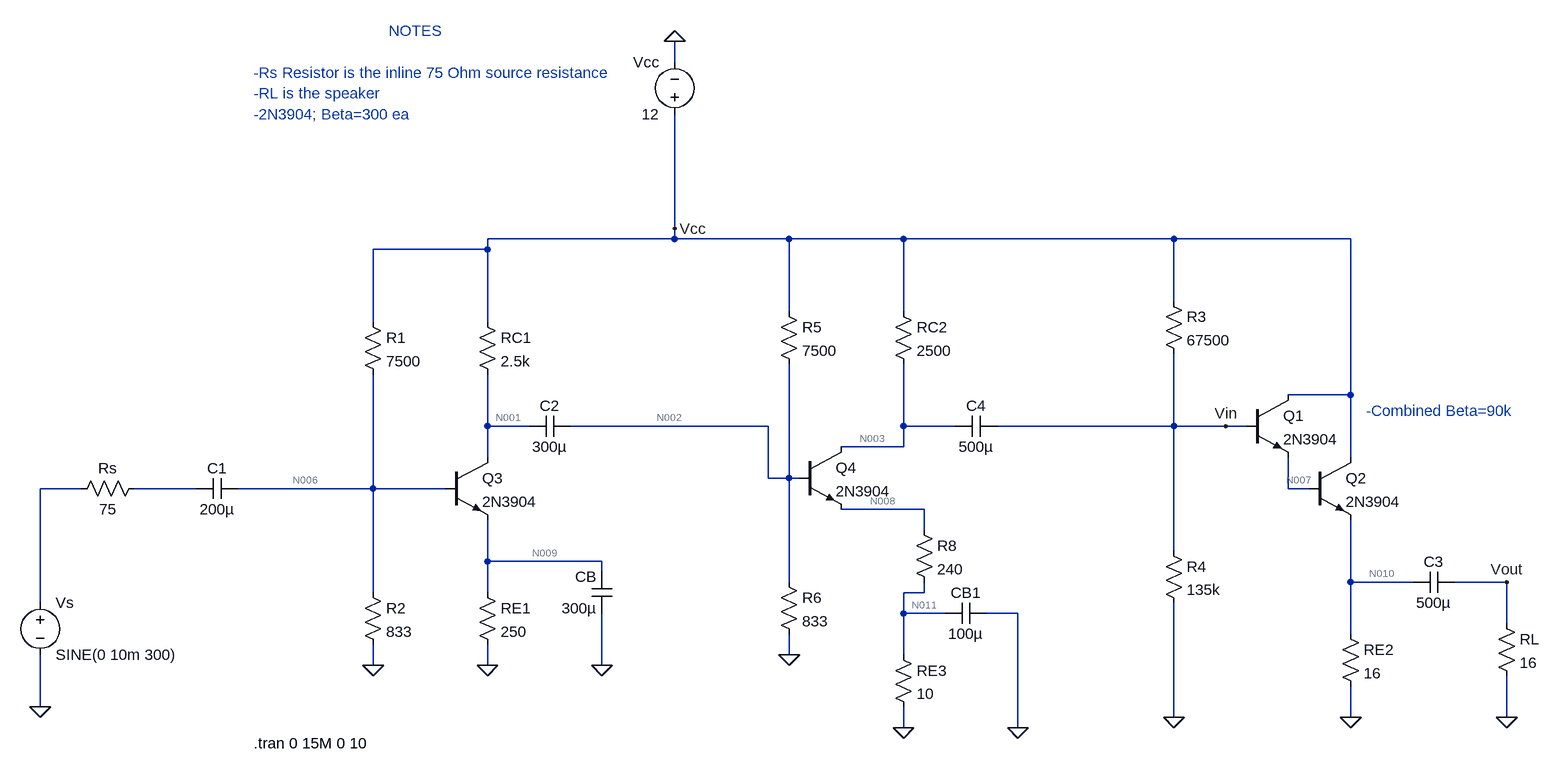
[diagram p0: schematic NewAmpSchematic.asc]
NewAmpSchematic.asc, the LTspice schematic file:
Version 4
SHEET 1 1416 680
WIRE -304 -448 -304 -480
WIRE -304 -192 -304 -368
WIRE -304 -176 -304 -192
WIRE -304 -176 -592 -176
WIRE -128 -176 -304 -176
WIRE 48 -176 -128 -176
WIRE 464 -176 48 -176
WIRE 736 -176 464 -176
WIRE -592 -160 -592 -176
WIRE -592 -160 -768 -160
WIRE 464 -80 464 -176
WIRE -128 -64 -128 -176
WIRE 48 -64 48 -176
WIRE -768 -48 -768 -160
WIRE -592 -48 -592 -160
WIRE 736 64 736 -176
WIRE 736 64 640 64
WIRE -592 112 -592 32
WIRE -528 112 -592 112
WIRE -160 112 -464 112
WIRE 48 112 48 16
WIRE 128 112 48 112
WIRE 464 112 464 0
WIRE 464 112 192 112
WIRE 544 112 464 112
WIRE 576 112 544 112
WIRE 48 144 48 112
WIRE 48 144 -48 144
WIRE -592 160 -592 112
WIRE 736 160 736 64
WIRE -160 192 -160 112
WIRE -128 192 -128 16
WIRE -128 192 -160 192
WIRE -112 192 -128 192
WIRE -1216 208 -1280 208
WIRE -1040 208 -1136 208
WIRE -768 208 -768 32
WIRE -768 208 -976 208
WIRE -656 208 -768 208
WIRE 640 208 640 160
WIRE 672 208 640 208
WIRE 80 240 -48 240
WIRE 80 272 80 240
WIRE 464 304 464 112
WIRE -592 320 -592 256
WIRE -416 320 -592 320
WIRE -416 336 -416 320
WIRE -128 352 -128 192
WIRE 736 352 736 256
WIRE 832 352 736 352
WIRE 976 352 896 352
WIRE -768 368 -768 208
WIRE -592 368 -592 320
WIRE 80 368 80 352
WIRE 80 368 48 368
WIRE -1280 384 -1280 208
WIRE 48 400 48 368
WIRE 112 400 48 400
WIRE 224 400 176 400
WIRE 976 416 976 352
WIRE 736 432 736 352
WIRE -128 464 -128 432
WIRE 48 464 48 400
WIRE -768 480 -768 448
WIRE -592 480 -592 448
WIRE -416 480 -416 400
WIRE -1280 544 -1280 464
WIRE 464 560 464 384
WIRE 736 560 736 512
WIRE 976 560 976 496
WIRE 48 576 48 544
WIRE 224 576 224 400
FLAG -1280 544 0
FLAG 464 560 0
FLAG 736 560 0
FLAG 976 560 0
FLAG 976 352 Vout
FLAG -768 480 0
FLAG -592 480 0
FLAG -416 480 0
FLAG -128 464 0
FLAG 48 576 0
FLAG 224 576 0
FLAG 544 112 Vin
FLAG -304 -192 Vcc
FLAG -304 -480 0
SYMBOL voltage -1280 368 R0
WINDOW 123 0 0 Left 2
WINDOW 39 0 0 Left 2
SYMATTR InstName Vs
SYMATTR Value SINE(0 10m 300)
SYMBOL voltage -304 -352 R180
WINDOW 0 24 96 Left 2
WINDOW 3 24 16 Left 2
SYMATTR InstName Vcc
SYMATTR Value 12
SYMBOL res -1120 192 R90
WINDOW 0 0 56 VBottom 2
WINDOW 3 32 56 VTop 2
SYMATTR InstName Rs
SYMATTR Value 75
SYMBOL cap -976 192 R90
WINDOW 0 0 32 VBottom 2
WINDOW 3 32 32 VTop 2
SYMATTR InstName C1
SYMATTR Value 200µ
SYMBOL res 448 -96 R0
SYMATTR InstName R3
SYMATTR Value 67500
SYMBOL res 448 288 R0
SYMATTR InstName R4
SYMATTR Value 135k
SYMBOL res 720 416 R0
SYMATTR InstName RE2
SYMATTR Value 16
SYMBOL npn 576 64 R0
SYMATTR InstName Q1
SYMATTR Value 2N3904
SYMBOL npn 672 160 R0
SYMATTR InstName Q2
SYMATTR Value 2N3904
SYMBOL cap 896 336 R90
WINDOW 0 0 32 VBottom 2
WINDOW 3 32 32 VTop 2
SYMATTR InstName C3
SYMATTR Value 500µ
SYMBOL res 960 400 R0
SYMATTR InstName RL
SYMATTR Value 16
SYMBOL npn -656 160 R0
SYMATTR InstName Q3
SYMATTR Value 2N3904
SYMBOL res -784 -64 R0
SYMATTR InstName R1
SYMATTR Value 7500
SYMBOL res -784 352 R0
SYMATTR InstName R2
SYMATTR Value 833
SYMBOL res -608 -64 R0
SYMATTR InstName RC1
SYMATTR Value 2.5k
SYMBOL res -608 352 R0
SYMATTR InstName RE1
SYMATTR Value 250
SYMBOL cap -464 96 R90
WINDOW 0 0 32 VBottom 2
WINDOW 3 32 32 VTop 2
SYMATTR InstName C2
SYMATTR Value 300µ
SYMBOL cap -400 400 R180
WINDOW 0 24 56 Left 2
WINDOW 3 24 8 Left 2
SYMATTR InstName CB
SYMATTR Value 300µ
SYMBOL npn -112 144 R0
SYMATTR InstName Q4
SYMATTR Value 2N3904
SYMBOL res -144 -80 R0
SYMATTR InstName R5
SYMATTR Value 7500
SYMBOL res -144 336 R0
SYMATTR InstName R6
SYMATTR Value 833
SYMBOL res 32 -80 R0
SYMATTR InstName RC2
SYMATTR Value 2500
SYMBOL res 32 448 R0
SYMATTR InstName RE3
SYMATTR Value 10
SYMBOL cap 192 96 R90
WINDOW 0 0 32 VBottom 2
WINDOW 3 32 32 VTop 2
SYMATTR InstName C4
SYMATTR Value 500µ
SYMBOL cap 112 416 R270
WINDOW 0 32 32 VTop 2
WINDOW 3 0 32 VBottom 2
SYMATTR InstName CB1
SYMATTR Value 100µ
SYMBOL res 64 256 R0
SYMATTR InstName R8
SYMATTR Value 240
TEXT -952 -432 Left 2 ;-Rs Resistor is the inline 75 Ohm source resistance
TEXT -952 -368 Left 2 ;-2N3904; Beta=300 ea
TEXT 760 88 Left 2 ;-Combined Beta=90k
TEXT -744 -496 Left 2 ;NOTES
TEXT -952 600 Left 2 !.tran 0 15M 0 10
TEXT -952 -400 Left 2 ;-RL is the speaker

The netlist it stands for:
* NewAmpSchematic.asc
Vs N004 0 SINE(0 10m 300)
Vcc Vcc 0 12
Rs N005 N004 75
C1 N006 N005 200µ
R3 Vcc Vin 67500
R4 Vin 0 135k
RE2 N010 0 16
Q1 Vcc Vin N007 0 2N3904
Q2 Vcc N007 N010 0 2N3904
C3 Vout N010 500µ
RL Vout 0 16
Q3 N001 N006 N009 0 2N3904
R1 Vcc N006 7500
R2 N006 0 833
RC1 Vcc N001 2.5k
RE1 N009 0 250
C2 N002 N001 300µ
CB 0 N009 300µ
Q4 N003 N002 N008 0 2N3904
R5 Vcc N002 7500
R6 N002 0 833
RC2 Vcc N003 2500
RE3 N011 0 10
C4 Vin N003 500µ
CB1 N011 0 100µ
R8 N008 N011 240
.model NPN NPN
.model PNP PNP
.lib standard.bjt
* -Rs Resistor is the inline 75 Ohm source resistance
* -2N3904; Beta=300 ea
* -Combined Beta=90k
* NOTES
.tran 0 15M 0 10
* -RL is the speaker
.backanno
.end

* Results of the author's LTspice run, read from the files saved beside the schematic
* Operating Point, zero values left out:
*   V(vcc) = 12 V
*   V(n006) = 1.195 V
*   V(vin) = 7.671 V
*   V(n010) = 6.088 V
*   V(n007) = 6.995 V
*   V(n001) = 6.801 V
*   V(n009) = 521.5 mV
*   V(n002) = 1.195 V
*   V(n003) = 6.801 V
*   V(n008) = 521.5 mV
*   V(n011) = 20.86 mV
*   Ic(Q4) = 2.079 mA
*   Ib(Q4) = 6.596 µA
*   Ie(Q4) = -2.086 mA
*   Ic(Q3) = 2.079 mA
*   Ib(Q3) = 6.596 µA
*   Ie(Q3) = -2.086 mA
*   Ic(Q2) = 378.2 mA
*   Ib(Q2) = 2.281 mA
*   Ie(Q2) = -380.5 mA
*   Ic(Q1) = 2.274 mA
*   Ib(Q1) = 7.306 µA
*   Ie(Q1) = -2.281 mA
*   I(R8) = 2.086 mA
*   I(Re3) = 2.086 mA
*   I(Rc2) = 2.079 mA
*   I(R6) = 1.434 mA
*   I(R5) = 1.441 mA
*   I(Re1) = 2.086 mA
*   I(Rc1) = 2.079 mA
*   I(R2) = 1.434 mA
*   I(R1) = 1.441 mA
*   I(Re2) = 380.5 mA
*   I(R4) = 56.82 µA
*   I(R3) = 64.13 µA
*   I(Vcc) = -387.6 mA
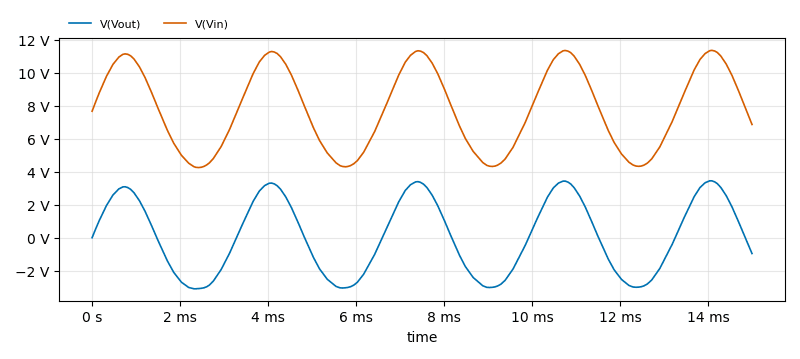
[diagram p1: Transient Analysis of NewAmpSchematic.asc, plotted from the saved traces]
* Transient Analysis, 1 run:
*   V(Vout): min -3.1 V, max 3.45 V, average 119.6 mV, rms 2.284 V, last -961.1 mV
*   V(Vin): min 4.254 V, max 11.36 V, average 7.836 V, rms 8.215 V, last 6.868 V